# EasyEDA schematic SCH_mechakey_2023-10-28.json
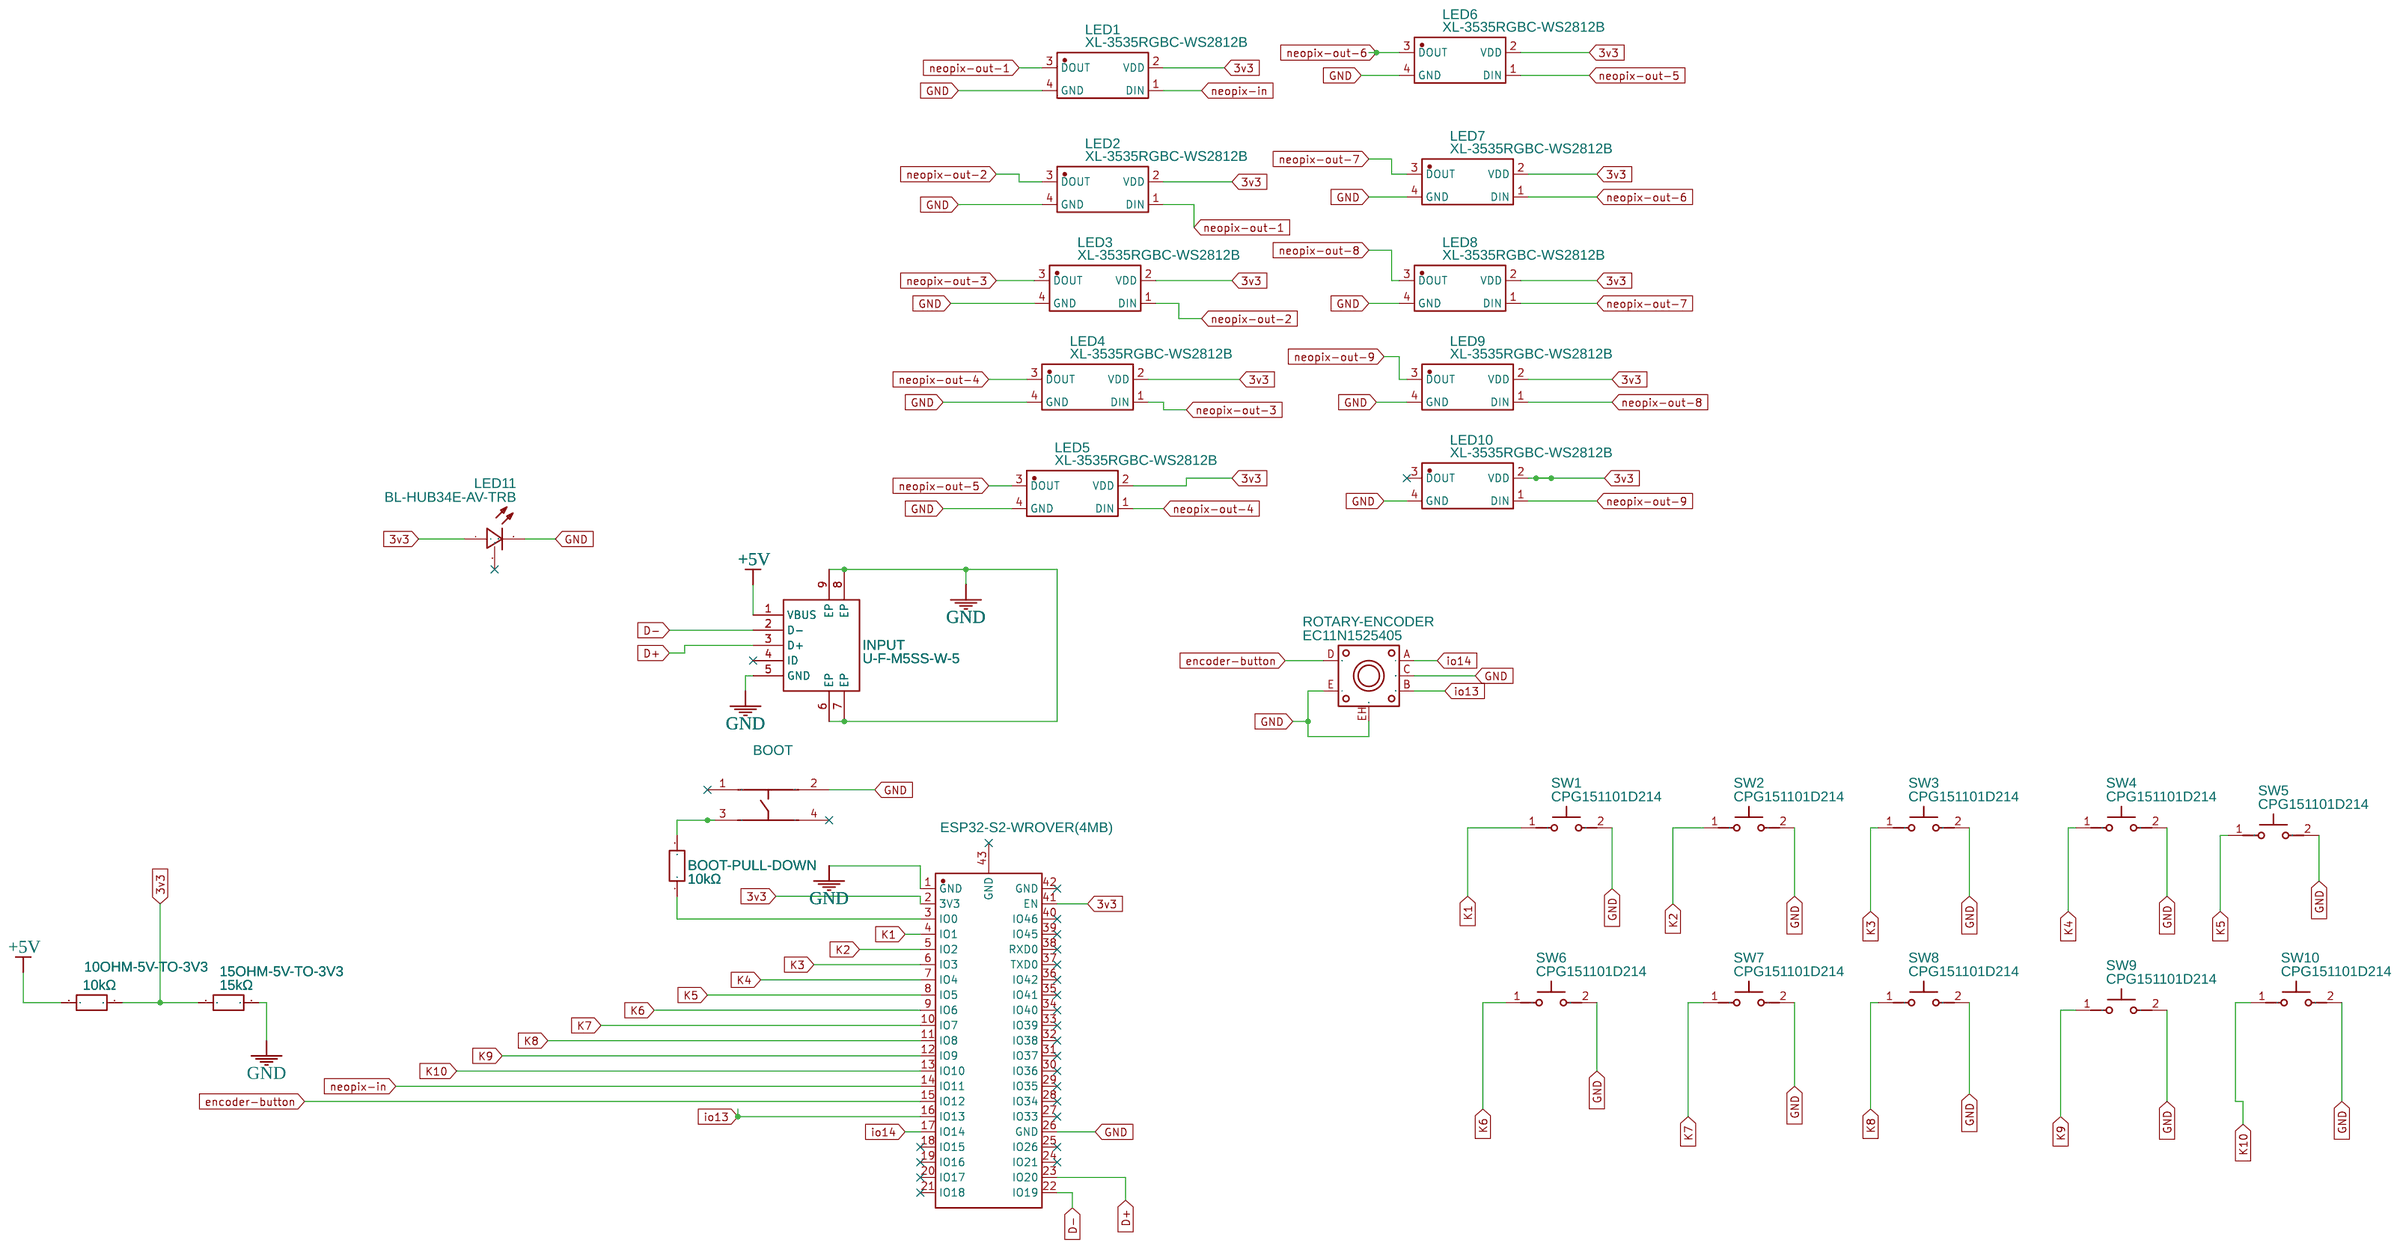
[diagram p0: schematic sheet]

## Parts
10OHM-5V-TO-3V3  10kΩ  [R0603]
15OHM-5V-TO-3V3  15kΩ  [RES-TH_BD2.3-L3.7-P7.70-D0.4]
BOOT  PTS810SJM250SMTRLFS  [KEY-SMD_4P-L4.2-W3.2-P2.20-LS4.6]
BOOT-PULL-DOWN  10kΩ  [R0603]
INPUT  U-F-M5SS-W-5  [MICRO-USB-SMD_MICRO-USB-A9]
LED1  XL-3535RGBC-WS2812B  [LED-SMD_XL-3535RGBC-WS2812B]
LED2  XL-3535RGBC-WS2812B  [LED-SMD_XL-3535RGBC-WS2812B]
LED3  XL-3535RGBC-WS2812B  [LED-SMD_XL-3535RGBC-WS2812B]
LED4  XL-3535RGBC-WS2812B  [LED-SMD_XL-3535RGBC-WS2812B]
LED5  XL-3535RGBC-WS2812B  [LED-SMD_XL-3535RGBC-WS2812B]
LED6  XL-3535RGBC-WS2812B  [LED-SMD_XL-3535RGBC-WS2812B]
LED7  XL-3535RGBC-WS2812B  [LED-SMD_XL-3535RGBC-WS2812B]
LED8  XL-3535RGBC-WS2812B  [LED-SMD_XL-3535RGBC-WS2812B]
LED9  XL-3535RGBC-WS2812B  [LED-SMD_XL-3535RGBC-WS2812B]
LED10  XL-3535RGBC-WS2812B  [LED-SMD_XL-3535RGBC-WS2812B]
LED11  BL-HUB34E-AV-TRB  [LED-SMD_LED-BL-HUB34E-AV-TRB]
ROTARY-ENCODER  EC11N1525405  [SW-TH_EC11NXXXX]
SW1  CPG151101D214  [KEY-TH_CPG151101D21X]
SW2  CPG151101D214  [KEY-TH_CPG151101D21X]
SW3  CPG151101D214  [KEY-TH_CPG151101D21X]
SW4  CPG151101D214  [KEY-TH_CPG151101D21X]
SW5  CPG151101D214  [KEY-TH_CPG151101D21X]
SW6  CPG151101D214  [KEY-TH_CPG151101D21X]
SW7  CPG151101D214  [KEY-TH_CPG151101D21X]
SW8  CPG151101D214  [KEY-TH_CPG151101D21X]
SW9  CPG151101D214  [KEY-TH_CPG151101D21X]
SW10  CPG151101D214  [KEY-TH_CPG151101D21X]
U1  ESP32-S2-WROVER(4MB)  [WIFI-SMD_ESP32-S2-WROVER-I]

## Library data of the parts
10OHM-5V-TO-3V3 BOOT-PULL-DOWN = ERJUP3F1002V: Contributor: LCSC; Supplier: LCSC; Supplier Part: C491211; Manufacturer: PANASONIC(松下); JLCPCB Part Class: Extended Part
15OHM-5V-TO-3V3 = CR1/8W-15K±5%-OT26: Contributor: lcsc; Supplier: LCSC; Supplier Part: C2896941; Manufacturer: VO(翔胜); JLCPCB Part Class: Extended Part
BOOT = PTS810SJM250SMTRLFS: Contributor: LCSC; Supplier: LCSC; Supplier Part: C116501; Manufacturer: C&K; JLCPCB Part Class: Extended Part
INPUT = U-F-M5SS-W-5: Contributor: LCSC; Supplier: LCSC; Manufacturer: 韩国韩荣; Supplier Part: C145781; JLCPCB Part Class: Extended Part
LED1-LED10 = XL-3535RGBC-WS2812B: Contributor: LCSC; Supplier: LCSC; Supplier Part: C2843786; Manufacturer: XINGLIGHT(成兴光); JLCPCB Part Class: Extended Part
LED11 = BL-HUB34E-AV-TRB: Contributor: LCSC; Supplier: LCSC; Supplier Part: C183874; Manufacturer: BrtLed(佰鸿); JLCPCB Part Class: Extended Part; link: https://lcsc.com/eda_search?q=C183874&%26type=1&ref=editor
ROTARY-ENCODER = EC11N1525405: Contributor: LCSC; Supplier: LCSC; Supplier Part: C470749; Manufacturer: ALPSALPINE(阿尔卑斯阿尔派); JLCPCB Part Class: Extended Part
SW1-SW10 = CPG151101D214: Contributor: LCSC; Supplier: LCSC; Supplier Part: C400232; Manufacturer: Kailh; JLCPCB Part Class: Extended Part
U1 = ESP32-S2-WROVER(4MB): Contributor: LCSC; Supplier: LCSC; Supplier Part: C701333; Manufacturer: ESPRESSIF(乐鑫); JLCPCB Part Class: Extended Part

## Nets
3v3: 10OHM-5V-TO-3V3.2 15OHM-5V-TO-3V3.1 LED1.2(VDD) LED2.2(VDD) LED3.2(VDD) LED4.2(VDD) LED5.2(VDD) LED6.2(VDD) LED7.2(VDD) LED8.2(VDD) LED9.2(VDD) LED10.2(VDD) LED11.1(A) U1.2(3V3) U1.41(EN)
+5V: 10OHM-5V-TO-3V3.1 INPUT.1(VBUS)
GND: 15OHM-5V-TO-3V3.2 BOOT.2 INPUT.5(GND) INPUT.6(EP) INPUT.7(EP) INPUT.8(EP) INPUT.9(EP) LED1.4(GND) LED2.4(GND) LED3.4(GND) LED4.4(GND) LED5.4(GND) LED6.4(GND) LED7.4(GND) LED8.4(GND) LED9.4(GND) LED10.4(GND) LED11.2(C) ROTARY-ENCODER.C ROTARY-ENCODER.E ROTARY-ENCODER.EH SW1.2 SW2.2 SW3.2 SW4.2 SW5.2 SW6.2 SW7.2 SW8.2 SW9.2 SW10.2 U1.1(GND) U1.26(GND)
D+: INPUT.3(D+) U1.23(IO20)
D-: INPUT.2(D-) U1.22(IO19)
encoder-button: ROTARY-ENCODER.D U1.15(IO12)
io13: ROTARY-ENCODER.B U1.16(IO13)
io14: ROTARY-ENCODER.A U1.17(IO14)
K1: SW1.1 U1.4(IO1)
K2: SW2.1 U1.5(IO2)
K3: SW3.1 U1.6(IO3)
K4: SW4.1 U1.7(IO4)
K5: SW5.1 U1.8(IO5)
K6: SW6.1 U1.9(IO6)
K7: SW7.1 U1.10(IO7)
K8: SW8.1 U1.11(IO8)
K9: SW9.1 U1.12(IO9)
K10: SW10.1 U1.13(IO10)
neopix-in: LED1.1(DIN) U1.14(IO11)
neopix-out-1: LED1.3(DOUT) LED2.1(DIN)
neopix-out-2: LED2.3(DOUT) LED3.1(DIN)
neopix-out-3: LED3.3(DOUT) LED4.1(DIN)
neopix-out-4: LED4.3(DOUT) LED5.1(DIN)
neopix-out-5: LED5.3(DOUT) LED6.1(DIN)
neopix-out-6: LED6.3(DOUT) LED7.1(DIN)
neopix-out-7: LED7.3(DOUT) LED8.1(DIN)
neopix-out-8: LED8.3(DOUT) LED9.1(DIN)
neopix-out-9: LED9.3(DOUT) LED10.1(DIN)
Net-(BOOT-3): BOOT.3 BOOT-PULL-DOWN.2
Net-(BOOT-PULL-DOWN-1): BOOT-PULL-DOWN.1 U1.3(IO0)

Not connected (* = marked no-connect by the designer): BOOT 1* 4*; INPUT 4(ID)*; LED10 3(DOUT)*; LED11 3*; U1 18(IO15)* 19(IO16)* 20(IO17)* 21(IO18)* 24(IO21)* 25(IO26)* 27(IO33)* 28(IO34)* 29(IO35)* 30(IO36)* 31(IO37)* 32(IO38)* 33(IO39)* 34(IO40)* 35(IO41)* 36(IO42)* 37(TXD0)* 38(RXD0)* 39(IO45)* 40(IO46)* 42(GND)* 43(GND)*
